# EAGLE design smokedetector (EAGLE 7.6.0)
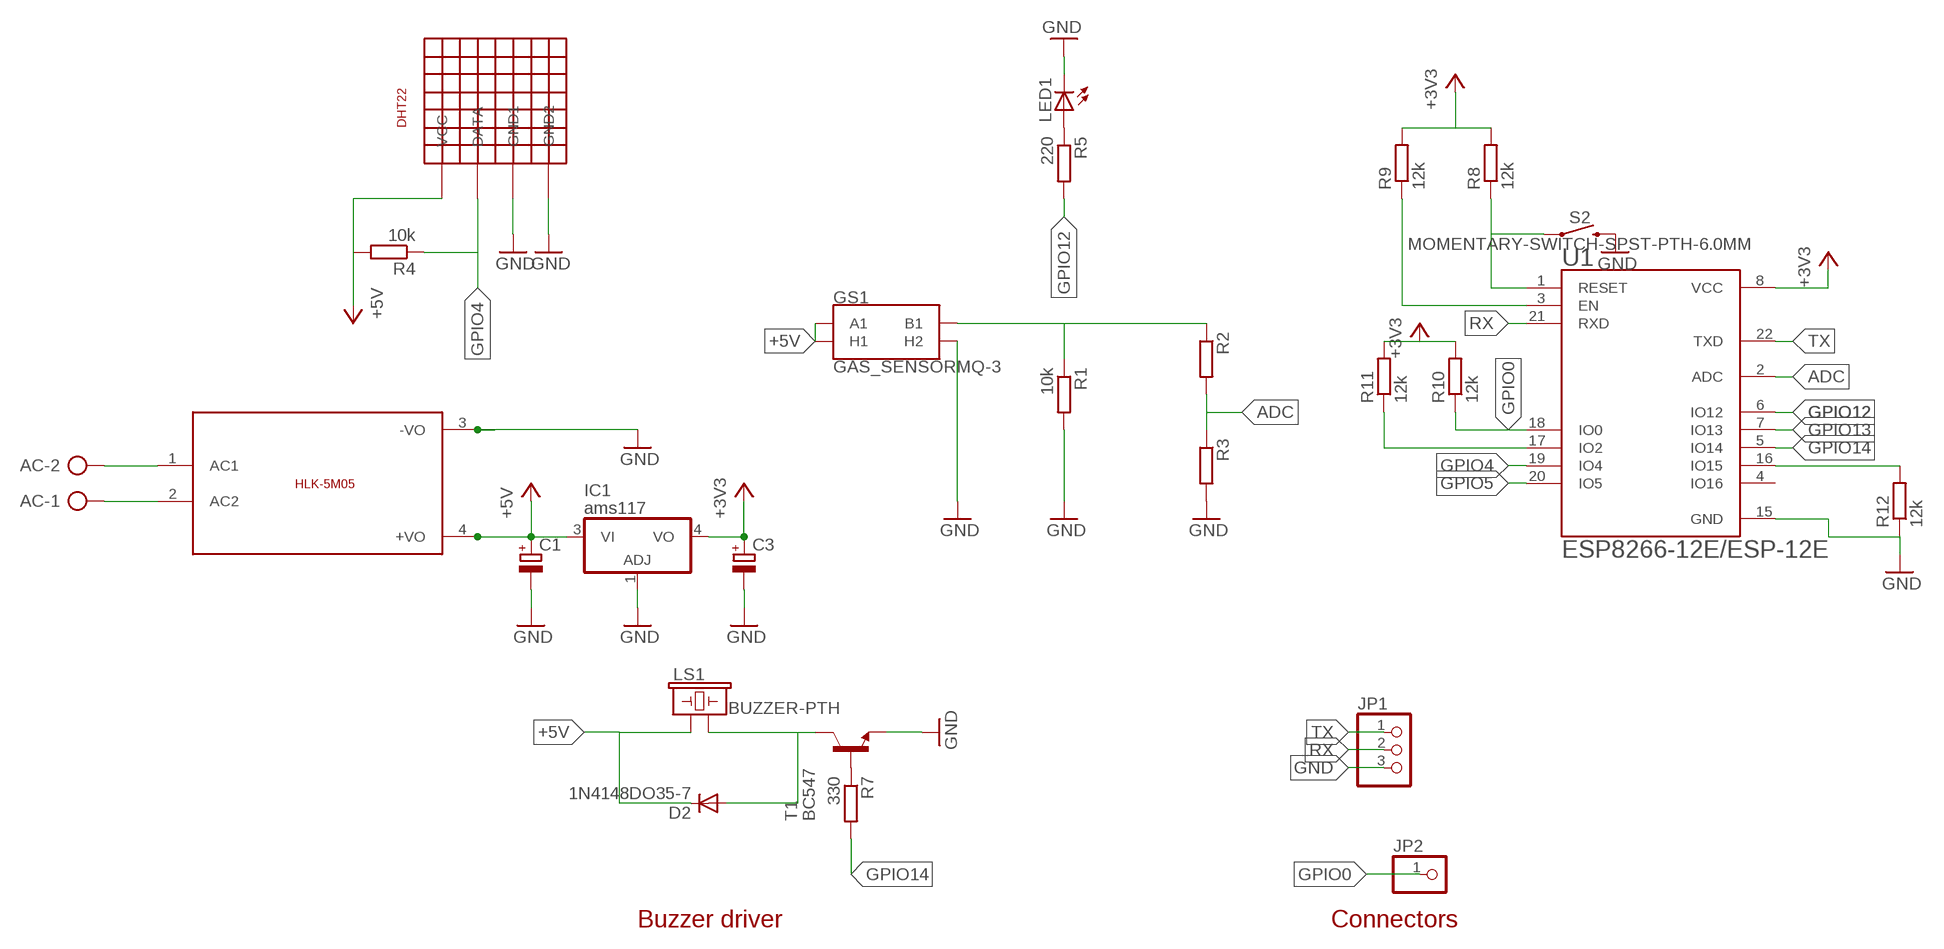
[diagram p0: schematic, sheet 1]

## Parts
AC  AK500/2-H  [AK500/2-H]
C1  CPOL-EUE2.5-6  [E2,5-6]
C3  CPOL-EUE2.5-6  [E2,5-6]
D2  1N4148DO35-7  [DO35-7]
DHT22  DHT22  [DHT22]
GS1  GAS_SENSORMQ-3  [GAS_SENSOR]
IC1  ams117  317EMP  [SOT223]
JP1  PINHD-1X3CB  [1X03-CLEANBIG]
JP2  PINHD-1X1CB  [1X01-CLEANBIG]
LED1  LED5MM  [LED5MM]
LS1  BUZZER-PTH  [BUZZER-12MM]
R1  10k  R-EU_0204/2V  [0204V]
R2  R-EU_0204/2V  [0204V]
R3  R-EU_0204/2V  [0204V]
R4  10k  R-EU_0204/2V  [0204V]
R5  220  R-EU_0204/2V  [0204V]
R7  330  R-EU_0204/2V  [0204V]
R8  12k  R-EU_0204/2V  [0204V]
R9  12k  R-EU_0204/2V  [0204V]
R10  12k  R-EU_0204/2V  [0204V]
R11  12k  R-EU_0204/2V  [0204V]
R12  12k  R-EU_0204/2V  [0204V]
S2  MOMENTARY-SWITCH-SPST-PTH-6.0MM  MOMENTARY-SWITCH-SPST-PTH-6.0MM-KIT  [TACTILE_SWITCH_PTH_6.0MM_KIT]
T1  BC547  [TO92]
U1  ESP8266-12E/ESP-12E  [XCVR_ESP8266-12E/ESP-12E]
U$2  HLK-5M05  [HLK-5M05]

## Nets
+3V3: C3.+ IC1.4(VO) R8.2 R9.2 R10.2 R11.2 U1.8(VCC)
+5V: C1.+ D2.C DHT22.P$1(VCC) GS1.A1 GS1.HA(H1) IC1.3(VI) LS1.+ R4.2 U$2.4(+VO)
ADC: R2.2 R3.1 U1.2(ADC)
GND: C1.- C3.- DHT22.P$3(GND1) DHT22.P$4(GND2) GS1.HB(H2) IC1.1(ADJ) JP1.3 LED1.K(C) R1.2 R3.2 R12.1 S2.3 T1.1(E) U1.15(GND) U$2.3(-VO)
GPIO0 [GPIO]: JP2.1 R10.1 U1.18(IO0)
GPIO4 [GPIO]: DHT22.P$2(DATA) R4.1 U1.19(IO4)
GPIO5: U1.20(IO5)
GPIO12: R5.2 U1.6(IO12)
GPIO13: U1.7(IO13)
GPIO14 [GPIO]: R7.2 U1.5(IO14)
N$1: R7.1 T1.2(B)
N$2: GS1.B1 R1.1 R2.1
N$3: R8.1 S2.1 U1.1(RESET)
N$4 [AC]: AC.1 U$2.2(AC2)
N$5 [AC]: AC.2 U$2.1(AC1)
N$6: D2.A LS1.- T1.3(C)
N$8: R9.1 U1.3(EN)
N$10 [GPIO]: LED1.A R5.1
N$14: R11.1 U1.17(IO2)
N$15: R12.2 U1.16(IO15)
RX [GPIO]: JP1.2 U1.21(RXD)
TX [GPIO]: JP1.1 U1.22(TXD)
Unconnected: U1.4(IO16)

## Notes on the sheet
- Buzzer driver | Connectors

## Library data of the parts
AC = con-ptr500:AK500/2-H: CONNECTOR Aug. 2004 / PTR Meßtechnik: Die Bezeichnung der Serie AK505 wurde geändert. Es handelt sich hierbei um AK500 in horizontaler Ausführung.; OC_FARNELL: unknown; OC_NEWARK: unknown
C1 C3 = rcl:CPOL-EU: POLARIZED CAPACITOR, European symbol
D2 = diode:1N4148: DIODE high speed (Philips)
DHT22 = Alfred:DHT22
GS1 = SparkFun-Sensors:GAS_SENSOR: Gas Sensors - MQ-3, MQ-4, MQ-6, MQ-7, MQ-8 Through-hole gas sensors with a heating coil and an analog output. Example Datasheet <https://cdn.sparkfun.com/datasheets/Sensors/Biometric/MQ-3%20ver1.3%20-%20Manual.pdf> SparkFun Products Gas Sensor Breakout Board <https://www.sparkfun.com/products/8891> (BOB-8891) - Breakout board compatible with all gas sensors. Alcohol Gas Sensor - MQ-3 <https://www.sparkfun.com/products/8880> (SEN-08880) Methane CNG Gas Sensor - MQ-4 <https://www.sparkfun.com/products/9404> (SEN-09404) LPG Gas Sensor - MQ-6 <https://www.sparkfun.com/products/9405> (SEN-09405) Carbon Monoxide Sensor - MQ-7 <https://www.sparkfun.com/products/9403> (SEN-09403) Hydrogen Gas Sensor - MQ-8 <https://www.sparkfun.com/products/10916> (SEN-10916); PROD_ID: COMP-12216; SF_ID: SEN-08880
IC1 = linear:*317: Positive VOLTAGE REGULATOR
JP1 = adafruit:PINHD-1X3: PIN HEADER
JP2 = adafruit:PINHD-1X1: Pin header 1x1 for 0.1" spacing With round pins
LED1 = adafruit:LED: LED OSRAM: - CHIPLED LG R971, LG N971, LY N971, LG Q971, LY Q971, LO R971, LY R971 LH N974, LH R974 LS Q976, LO Q976, LY Q976 LO Q996 - Hyper CHIPLED LW Q18S LB Q993, LB Q99A, LB R99A - SideLED LS A670, LO A670, LY A670, LG A670, LP A670 LB A673, LV A673, LT A673, LW A673 LH A674 LY A675 LS A676, LA A676, LO A676, LY A676, LW A676 LS A679, LY A679, LG A679 - Hyper Micro SIDELED® LS Y876, LA Y876, LO Y876, LY Y876 LT Y87S - SmartLED LW L88C, LW L88S LB L89C, LB L89S, LG L890 LS L89K, LO L89K, LY L89K LS L896, LA L896, LO L896, LY L896 - TOPLED LS T670, LO T670, LY T670, LG T670, LP T670 LSG T670, LSP T670, LSY T670, LOP T670, LYG T670 LG T671, LOG T671, LSG T671 LB T673, LV T673, LT T673, LW T673 LH T674 LS T676, LA T676, LO T676, LY T676, LB T676, LH T676, LSB T676, LW T676 LB T67C, LV T67C, LT T67C, LS T67K, LO T67K, LY T67K, LW E67C LS E67B, LA E67B, LO E67B, LY E67B, LB E67C, LV E67C, LT E67C LW T67C LS T679, LY T679, LG T679 LS T770, LO T770, LY T770, LG T770, LP T770 LB T773, LV T773, LT T773, LW T773 LH T774 LS E675, LA E675, LY E675, LS T675 LS T776, LA T776, LO T776, LY T776, LB T776 LHGB T686 LT T68C, LB T68C - Hyper Mini TOPLED® LB M676 - Mini TOPLED Santana® LG M470 LS M47K, LO M47K, LY M47K Source: http://www.osram.convergy.de/
LS1 = SparkFun-Electromechanical:BUZZER: Buzzer Small round buzzers that operate around the audible 2kHz range. You can use these as speakers to create simple music or user interfaces. Variant Overview: PTH - Mini Speaker - PC Mount 12mm 2.048kHz <https://www.sparkfun.com/products/7950> PTH_KIT - Mini Speaker - PC Mount 12mm 2.048kHz <https://www.sparkfun.com/products/7950> KIT simplifies soldering by adding stop mask to one side of the pads. PTH_NO_SILK - Mini Speaker - PC Mount 12mm 2.048kHz <https://www.sparkfun.com/products/7950> No silkscreen indicator of buzzer outline. PTH_KIT_NO_SILK - Mini Speaker - PC Mount 12mm 2.048kHz <https://www.sparkfun.com/products/7950> KIT package w/o silkscreen SMD - Buzzer Audio Magnetic (CCV-084B16) SMD buzzer used on, e.g. the LilyPad Buzzer <https://www.sparkfun.com/products/8463> and RFID USB Reader <https://www.sparkfun.com/products/9963>. SMD_KIT - Buzzer Audio Magnetic (CCV-084B16) SMD Buzzer with elongated pins to make soldering easier. Used on the SparkFun Simon Says - Surface Mount Soldering Kit <https://www.sparkfun.com/products/10935>.; PROD_ID: COMP-08253; SF_SKU: COM-07950
R1-R5 R7-R12 = resistor:R-EU_: RESISTOR, European symbol
S2 = SparkFun-Switches:MOMENTARY-SWITCH-SPST: Momentary Switch (Pushbutton) - SPST Normally-open (NO) SPST momentary switches (buttons, pushbuttons). Variants PTH-12MM - 12mm square, through-hole Momentary Pushbutton Switch - 12mm Square <https://www.sparkfun.com/products/9190> (COM-09190) PTH-6.0MM, PTH-6.0MM-KIT - 6.0mm square, through-hole Mini Pushbutton Switch <https://www.sparkfun.com/products/97> (COM-00097) KIT package intended for soldering kit's - only one side of pads' copper is exposed. PTH-RIGHT-ANGLE-KIT - Right-angle, through-hole Right Angle Tactile Button <https://www.sparkfun.com/products/10791> - Used on SparkFun BigTime Watch Kit <https://www.sparkfun.com/products/11734> SMD-12MM - 12mm square, surface-mount Tactile Button - SMD (12mm) <https://www.sparkfun.com/products/12993> (COM-12993) Used on SparkFun PicoBoard <https://www.sparkfun.com/products/11888> SMD-4.5MM - 4.5mm Square Trackball Switch Used on SparkFun Blackberry Trackballer Breakout <https://www.sparkfun.com/products/13169> SMD-4.6MMX2.8MM - 4.60mm x 2.80mm, surface mount Used on SparkFun SAMD21 Mini Breakout <https://www.sparkfun.com/products/13664> SMD-5.2MM, SMD-5.2-REDUNDANT - 5.2mm square, surface-mount Mini Pushbutton Switch - SMD <https://www.sparkfun.com/products/8720> (COM-08720) Used on Arduino Pro Mini <https://www.sparkfun.com/products/11114> REDUNDANT package connects both switch circuits together SMD-6.0X3.5MM - 6.0 x 3.5mm, surface mount Momentary Reset Switch SMD <https://www.sparkfun.com/products/8229> (COM-08229) SMD-6.2MM-TALL - 6.2mm square, surface mount Tactile Button - SMD (6mm) <https://www.sparkfun.com/products/12992> Used on SparkFun Digital Sandbox <https://www.sparkfun.com/products/12651> SMD-RIGHT-ANGLE - Right-angle, surface mount Used on SparkFun Block for Intel® Edison - Arduino <https://www.sparkfun.com/products/13036>; PROD_ID: SWCH-08441; SF_SKU: COM-00097
T1 = transistor:BC547: NPN TRANSISTOR
U1 = ESP8266-12E_ESP-12E:ESP8266-12E/ESP-12E: ESP-12E WiFi Module; AVAILABILITY: Unavailable; DESCRIPTION: This WiFi module has a 32-bit MCU micro and clock speeds supporting 80 MHz or 160 MHz. Supports the RTOS and integrated Wi-Fi MAC/BB/RF/PA/LNA, and has an on-board antenna.; MF: AI-Thinker; MP: ESP8266-12E/ESP-12E; PACKAGE: None; PRICE: None
U$2 = HLK-5M05:HLK-5M05: HLK-5M05 is an 5Volt/5W smps developed by HI-LINK; AVAILABILITY: Unavailable; MF: Hi-link; MP: HLK-5M05; PACKAGE: Package Analog Devices; PRICE: None

## Net classes
0 default: width 0.4 mm, drill 0.7 mm, clearance 0.254 mm
1 AC: width 1 mm, drill 0.7 mm, clearance 0.254 mm to class 0, clearance 0.254 mm
2 GPIO: width 0.35 mm, drill 0.7 mm, clearance 0.254 mm to class 0, clearance 0.254 mm to class 1, clearance 0.254 mm
3 zerocross: width 0.35 mm, drill 0.7 mm, clearance 0.254 mm to class 0, clearance 0.254 mm to class 1, clearance 0.254 mm to class 2, clearance 0.254 mm

## Board
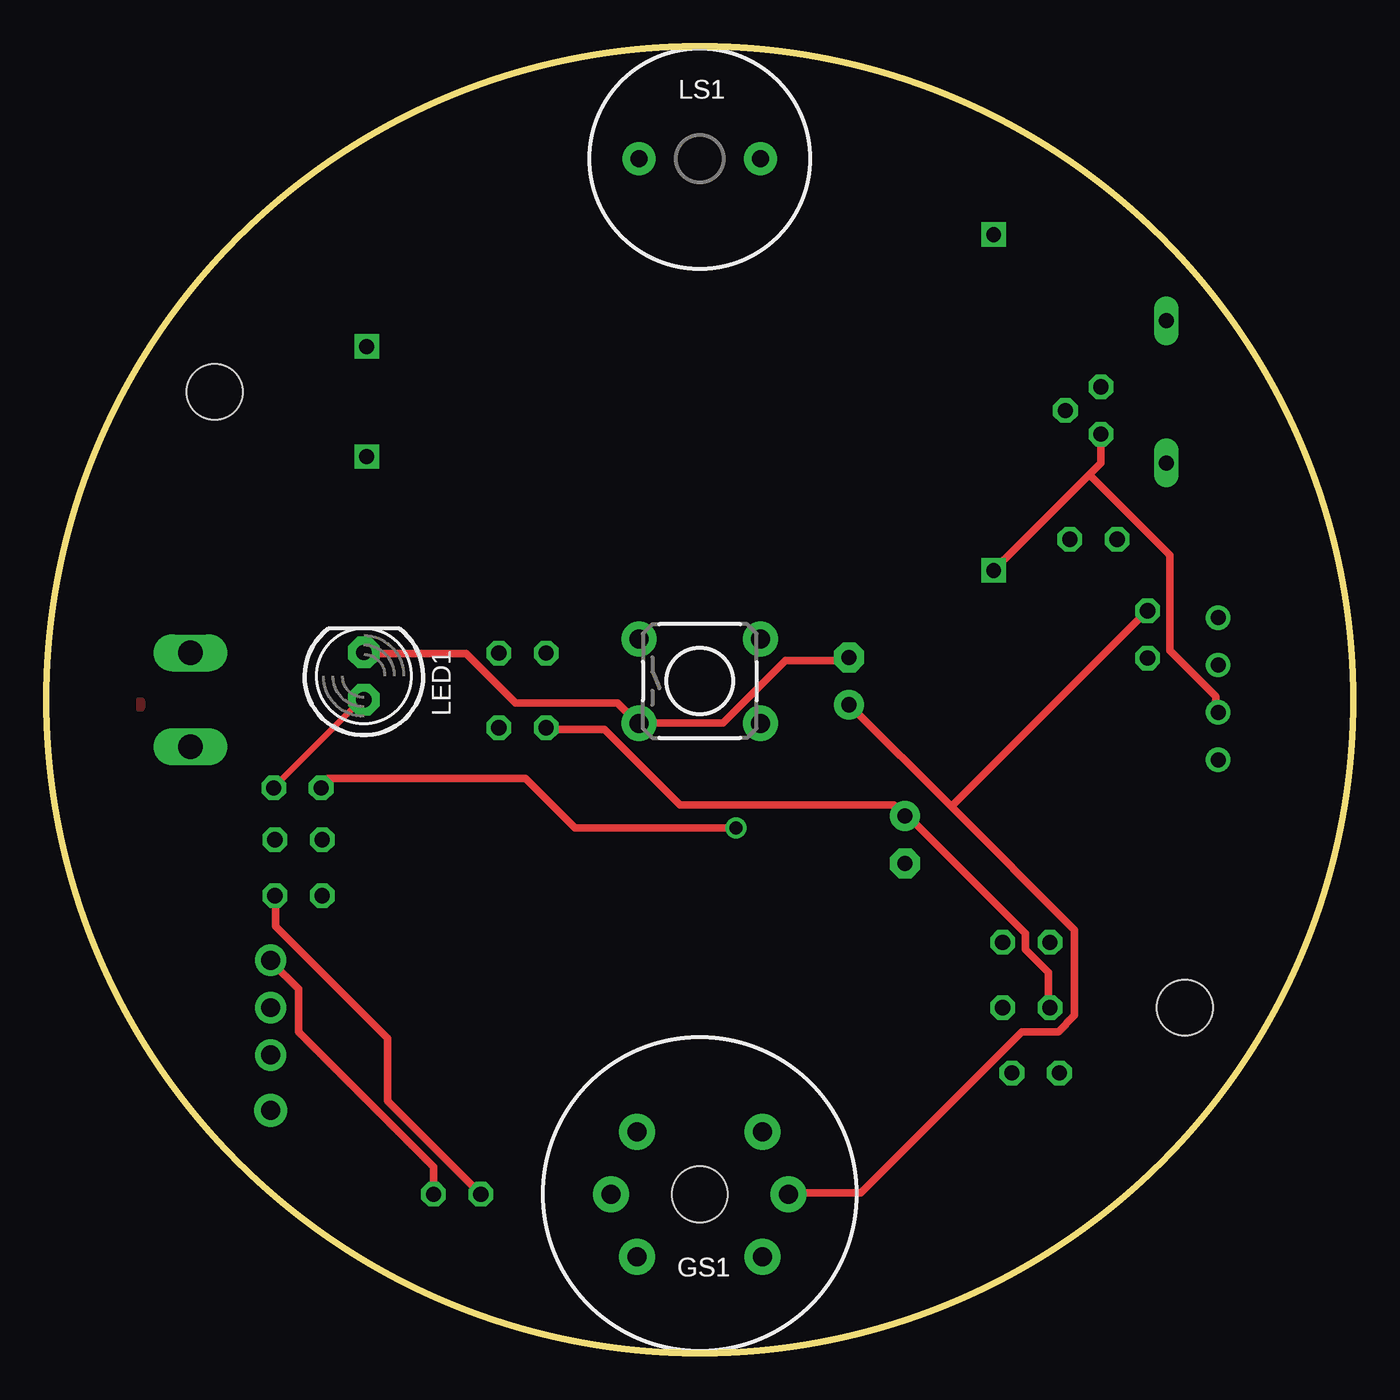
[diagram p1: board, top side]
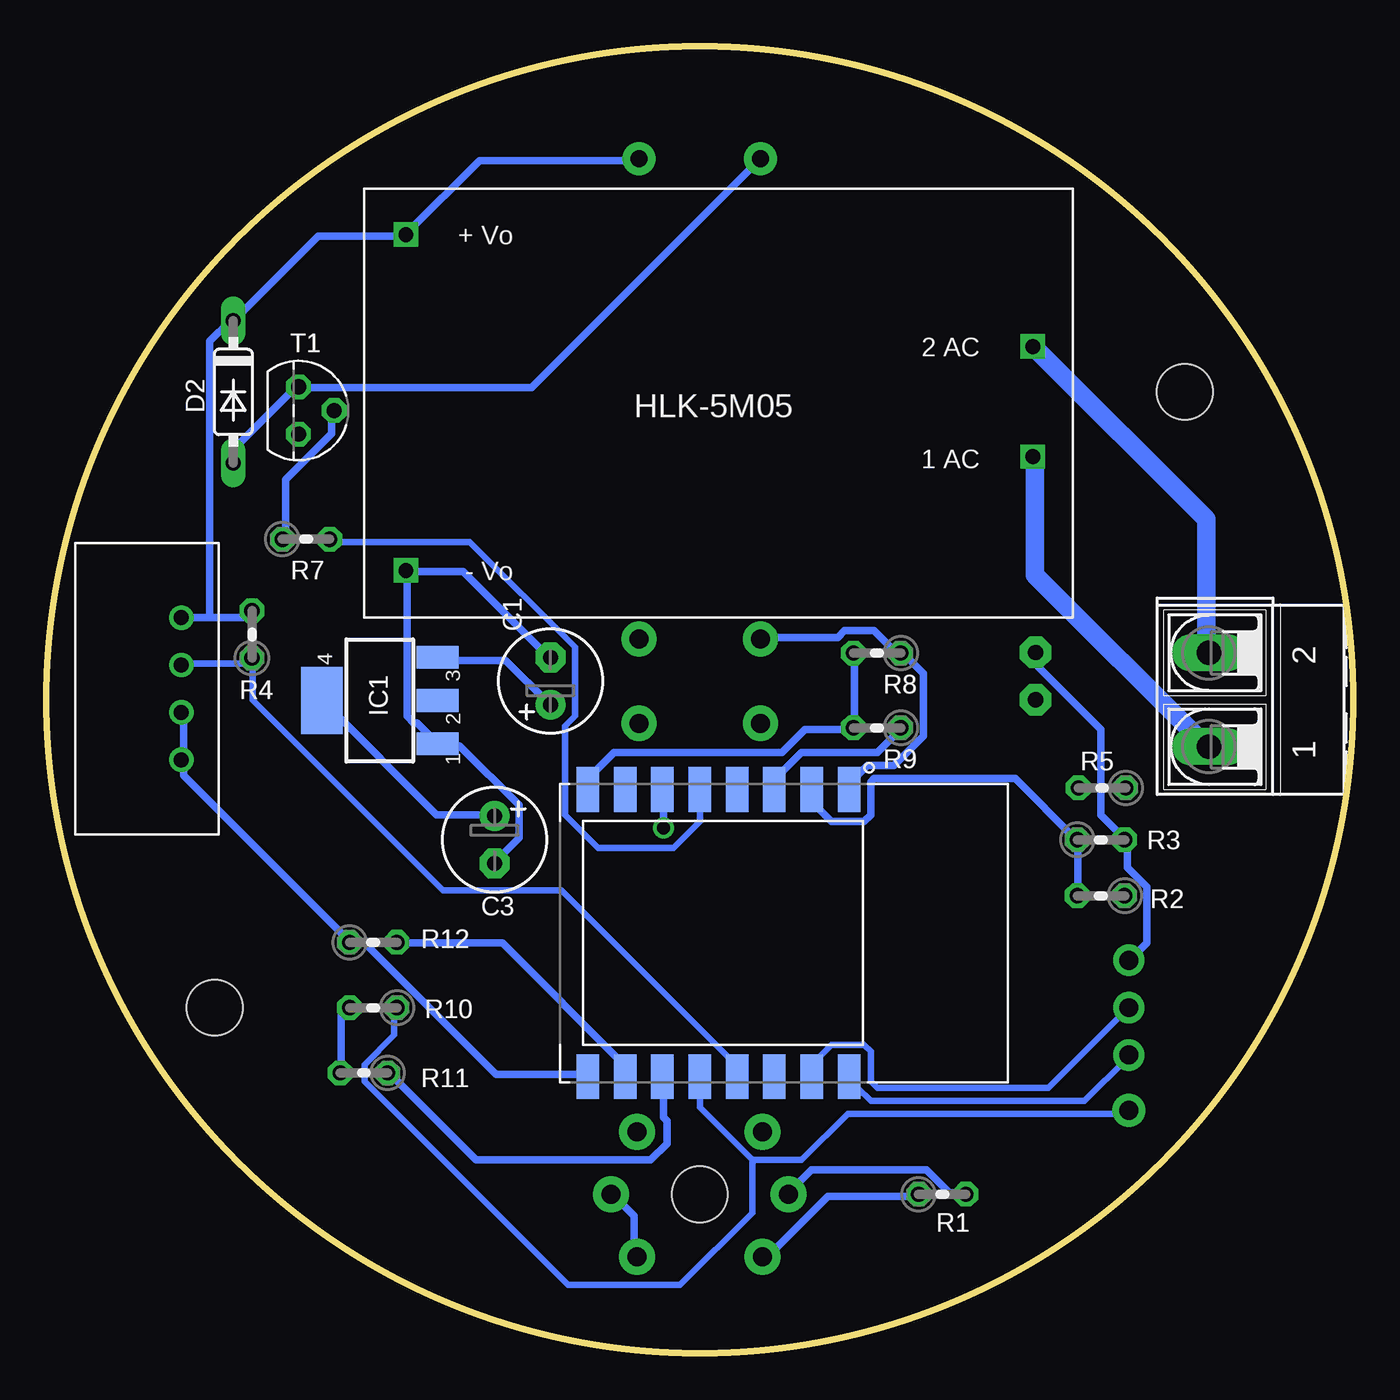
[diagram p2: board, bottom side, seen from below]

Size 70 x 70 mm. Coordinates in mm from the lower left corner, seen from the top.
Outline: circle at 35,35 radius 35
Copper layers (1*16): Top 0.035mm / dielectric 1.5mm / Bottom 0.035mm
Design rules "default *": minimum track width 10mil, minimum drill 24mil, track to track 12mil, track to pad 12mil, pad to pad 12mil, via to via 12mil, smd to smd 8mil, copper to edge 40mil, drill to drill 8mil, minimum pad ring 10mil, minimum via ring 8mil, stop-mask expansion 4mil, vias tented up to drill 0mil, thermal gap 10mil
Holes 3 mm at 9,51.5 61,18.5

### Footprints (pad centres in the part's own frame; a part is rotated, then mirrored left to right if it is on the bottom)
AK500/2-H = drill 1.321 long: 1 -2.515,0; 2 2.515,0
E2,5-6 = drill 0.813 pad 1.6: + -1.27,0 | drill 0.813 pad 1.6 octagon: - 1.27,0
DO35-7 = drill 0.813 long: A 3.81,0; C -3.81,0
DHT22 = drill 0.8: P$1 2.54,-2; P$2 5.08,-2; P$3 7.62,-2; P$4 10.16,-2
GAS_SENSOR = drill 1.016 pad 1.93: A1 -3.35,3.35; A2 -3.35,-3.35; B1 3.35,3.35; B2 3.35,-3.35; HA -4.75,0; HB 4.75,0 | hole 3: 0,0
SOT223 = smd 1.219 x 2.235: 1 -2.311,-3.099; 2 0,-3.099; 3 2.311,-3.099 | smd 3.6 x 2.2: 4 0,3.099
1X03-CLEANBIG = drill 1.016 pad 1.676: 1 -2.54,0; 2 0,0; 3 2.54,0
1X01-CLEANBIG = drill 1.016 pad 1.778: 1 0,0
LED5MM = drill 0.813 pad 1.676 octagon: A -1.27,0; K 1.27,0
BUZZER-12MM = drill 0.9 pad 1.778: + 3.25,0; - -3.25,0
0204V = drill 0.813 octagon: 1 -1.27,0; 2 1.27,0
TACTILE_SWITCH_PTH_6.0MM_KIT = drill 1.016 pad 1.88: 1 -3.251,2.261; 2 3.251,2.261; 3 -3.251,-2.261; 4 3.251,-2.261
TO92 = drill 0.813 octagon: 1 1.27,0; 2 0,1.905; 3 -1.27,0
XCVR_ESP8266-12E/ESP-12E = smd 2.4 x 1.2: 1 -7.7,7; 2 -7.7,5; 3 -7.7,3; 4 -7.7,1; 5 -7.7,-1; 6 -7.7,-3; 7 -7.7,-5; 8 -7.7,-7; 15 7.7,-7; 16 7.7,-5; 17 7.7,-3; 18 7.7,-1; 19 7.7,1; 20 7.7,3; 21 7.7,5; 22 7.7,7
HLK-5M05 = drill 0.8 square: 1 -16.85,-2.93; 2 -16.85,2.97; 3 16.75,9.07; 4 16.75,-8.93

### Placement (x,y rotation side)
AC  7.71,35 90 bottom
C1  43,36 90 bottom
C3  46,27.5 270 bottom
D2  60,51.5 270 bottom
DHT22  60.78,41.94 270 bottom
GS1  35,8.5 180 top
IC1  52.15,34.96 90 bottom
JP1  12,18.5 90 bottom
JP2  12,13 0 bottom
LED1  17,36.27 90 top
LS1  35,64 0 top
R1  22,8.5 0 bottom
R2  13.5,24.5 180 bottom
R3  13.5,27.5 0 bottom
R4  59,38.5 90 bottom
R5  13.44,30.28 180 bottom
R7  56.1,43.6 0 bottom
R8  25.5,37.5 180 bottom
R9  25.5,33.5 180 bottom
R10  52.5,18.5 180 bottom
R11  53,15 180 bottom
R12  52.5,22 0 bottom
S2  35,36 0 top
T1  56.5,50.5 270 bottom
U1  34,22.5 270 bottom
U$2  34,51 180 bottom

### Tracks (layer width: path | path; a pad name or v marks a point on that pad's centre or on a via)
+3V3
  Top 0.4: R10.2 53.68,18.61 53.68,20.38 52.44,21.61 52.44,22.49 46.1,28.83 C3.+ 45.92,28.83 45.4,29.36 33.94,29.36 29.89,33.41 26.89,33.41 R9.2
  Bottom 0.4: U1.8 40.99,30.24 40.99,30.77 39.58,32.18 30.59,32.18 29.36,33.41 26.89,33.41 R9.2 26.72,33.59 26.72,37.47 R8.2 | R11.2 54.21,15.09 54.21,18.09 53.85,18.44 R10.2 | C3.+ 46.1,28.83 49.1,28.83 55.09,34.82 IC1.4
  pour Top: 5,34.5 5,35 arc-90
+5V
  Top 0.4: 48.48,29.27 43.1,34.65 C1.+ | 48.48,29.27 55.09,22.67 55.09,18.09 54.21,17.2 52.27,17.2 43.63,8.57 39.76,8.57 GS1.HA | 48.48,29.27 58.96,39.76 R4.2
  Bottom 0.4: GS1.A1 38.52,5.22 38.52,7.34 39.58,8.39 GS1.HA | IC1.3 48.92,37.11 45.4,37.11 43.1,34.82 C1.+ | 61.25,39.41 59.49,39.41 59.14,39.76 R4.2 | 61.25,39.41 62.66,39.41 DHT22.P$1 | LS1.+ 38.35,63.9 46.8,63.9 50.68,60.02 U$2.4 50.86,59.84 55.44,59.84 59.84,55.44 D2.C 60.2,55.26 61.25,54.21 61.25,39.41
ADC
  Bottom 0.4: U1.2 28.83,30.07 28.83,29.36 27.95,28.48 26.19,28.48 25.84,28.83 25.84,30.59 25.66,30.77 18.09,30.77 14.91,27.6 R3.1 14.74,27.42 14.74,24.6 R2.2
GND
  Top 0.4: R1.2 20.73,8.57 20.73,9.98 13.5,17.2 13.5,19.49 12.09,20.9 JP1.3 | 55.88,47.07 50.86,42.05 U$2.3 | 55.88,47.07 56.5,47.69 56.5,49.1 T1.1 | C1.- 42.93,37.11 39.58,37.11 36.23,33.77 31.83,33.77 S2.3 31.65,33.77 30.59,34.82 25.13,34.82 22.49,37.47 17.03,37.47 LED1.K | 55.88,47.07 60.2,42.75 60.2,37.64 62.66,35.18 62.66,34.47 DHT22.P$3
  Bottom 0.4: R1.2 20.9,8.57 21.61,8.57 22.84,9.8 29.01,9.8 30.24,8.57 GS1.HB | JP1.3 11.92,21.08 11.04,21.96 11.04,24.96 12.09,26.01 12.09,27.42 R3.2 12.27,27.6 13.5,28.83 13.5,33.41 16.85,36.76 16.85,37.47 LED1.K | DHT22.P$3 62.66,34.3 62.66,31.83 DHT22.P$4 62.66,31.65 62.66,30.95 53.85,22.14 R12.1 53.68,21.96 52.97,21.96 45.92,14.91 41.17,14.91 U1.15 | C3.- 45.92,26.37 44.69,27.6 44.69,29.36 47.86,32.53 48.92,32.53 IC1.1 49.1,32.71 50.15,33.77 50.33,33.77 50.68,34.12 50.68,41.7 U$2.3 50.68,41.87 47.69,41.87 43.1,37.29 C1.-
GPIO0
  Bottom 0.35: U1.18 35,13.15 32.18,10.33 | 32.18,10.33 29.54,10.33 27.07,12.8 12.27,12.8 12.09,12.98 JP2.1 | 32.18,10.33 32.18,7.51 36.06,3.64 42.05,3.64 52.97,14.56 52.97,15.44 51.39,17.03 51.39,18.44 R10.1
GPIO4
  Bottom 0.35: 58.96,36.94 58.96,37.11 R4.1 58.96,36.94 | 58.96,36.94 58.96,35 48.74,24.78 42.4,24.78 33.06,15.44 33.06,14.91 U1.19 | 58.96,36.94 62.66,36.94 DHT22.P$2
GPIO12  (via drill 0.7)
  Top 0.4: v36.94,28.13 28.3,28.13 25.66,30.77 15.09,30.77 14.74,30.42 R5.2
  Bottom 0.4: v36.94,28.13 36.94,30.07 U1.6
GPIO14
  Bottom 0.35: U1.5 35,28.48 36.41,27.07 40.46,27.07 42.22,28.83 42.22,33.59 41.7,34.12 41.7,37.82 47.33,43.46 54.73,43.46 R7.2
N$1
  Bottom 0.4: R7.1 57.2,43.63 57.2,46.8 54.73,49.27 54.73,50.33 T1.2
N$2
  Top 0.4: R2.1 12.27,24.43 12.27,22.84 18.26,16.85 18.26,13.5 23.2,8.57 R1.1
  Bottom 0.4: R1.1 23.37,8.39 28.13,8.39 31.48,5.05 GS1.B1
N$3
  Bottom 0.4: U1.1 26.89,30.24 26.89,30.59 26.01,31.48 24.6,31.48 23.02,33.06 23.02,36.41 24.08,37.47 R8.1 24.43,37.47 25.66,38.7 27.25,38.7 27.6,38.35 31.65,38.35 S2.1
N$4
  Bottom 1: U$2.2 17.03,47.86 17.03,41.7 7.87,32.53 AC.1
N$5
  Bottom 1: U$2.1 17.03,53.85 7.87,44.69 7.87,37.64 AC.2
N$6
  Bottom 0.4: D2.A 59.84,47.86 59.84,48.57 56.67,51.74 T1.3 56.32,51.74 48.39,51.74 | 31.83,63.9 LS1.-
  Bottom 0.406: 48.39,51.74 44.01,51.74 LS1.-
N$8
  Bottom 0.4: U1.3 30.95,30.24 30.95,30.77 29.54,32.18 25.48,32.18 24.25,33.41 R9.1
N$10
  Top 0.35: R5.1 12.27,30.42 16.85,35 LED1.A
N$14
  Bottom 0.4: U1.17 36.94,14.74 36.94,12.62 36.76,12.45 36.76,11.21 37.64,10.33 46.98,10.33 51.56,14.91 R11.1
N$15
  Bottom 0.4: U1.16 39.05,14.91 39.05,15.44 45.57,21.96 51.21,21.96 R12.2
RX
  Bottom 0.35: U1.21 28.83,14.91 28.83,15.62 27.95,16.5 26.19,16.5 25.84,16.15 25.84,14.56 25.48,14.21 16.32,14.21 12.09,18.44 JP1.2
TX
  Bottom 0.35: U1.22 26.89,14.74 26.54,14.39 26.54,14.21 25.84,13.5 14.39,13.5 12.09,15.79 JP1.1

### Text on the board
_tNames: LS1 | LED1 | GS1
_bNames: T1 | D2 | R7 | C1 | R8 | R4 | IC1 | R5 | R9 | R3 | R2 | C3 | R12 | R10 | R11 | R1